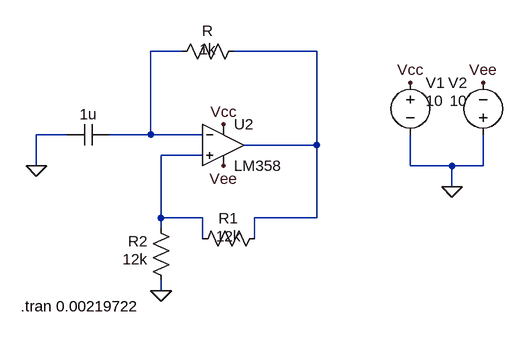
[diagram p0: schematic electronica.asc]
electronica.asc, the LTspice schematic file:
Version 4
SHEET 1 880 680
WIRE 80 0 32 0
WIRE 288 0 160 0
WIRE -96 128 -144 128
WIRE 32 128 32 0
WIRE 32 128 -32 128
WIRE 112 128 32 128
WIRE 288 144 288 0
WIRE 288 144 176 144
WIRE 112 160 48 160
WIRE -144 176 -144 128
WIRE 432 176 432 128
WIRE 496 176 432 176
WIRE 544 176 544 128
WIRE 544 176 496 176
WIRE 496 208 496 176
WIRE 48 256 48 160
WIRE 112 256 48 256
WIRE 288 256 288 144
WIRE 288 256 192 256
WIRE 48 272 48 256
WIRE 112 288 112 256
WIRE 192 288 192 256
WIRE 48 368 48 352
FLAG 496 208 0
FLAG 432 48 Vcc
FLAG 544 48 Vee
FLAG 144 176 Vee
FLAG 144 112 Vcc
FLAG -144 176 0
FLAG 48 368 0
SYMBOL res 176 -16 R90
WINDOW 0 0 56 VBottom 2
WINDOW 3 28 56 VBottom 2
SYMATTR InstName R
SYMATTR Value 1k
SYMBOL res 208 272 R90
WINDOW 0 0 56 VBottom 2
WINDOW 3 28 56 VBottom 2
SYMATTR InstName R1
SYMATTR Value 12k
SYMBOL res 64 368 R180
WINDOW 0 36 76 Left 2
WINDOW 3 36 48 Left 2
SYMATTR InstName R2
SYMATTR Value 12k
SYMBOL cap -32 112 R90
WINDOW 0 0 32 VBottom 2
WINDOW 3 32 32 VTop 2
SYMATTR InstName 1u
SYMATTR Value ""
SYMBOL voltage 432 32 R0
WINDOW 123 0 0 Left 0
WINDOW 39 0 0 Left 0
WINDOW 3 24 44 Left 2
SYMATTR InstName V1
SYMATTR Value 10
SYMBOL voltage 544 144 R180
WINDOW 0 24 96 Left 2
WINDOW 3 24 68 Left 2
WINDOW 123 0 0 Left 0
WINDOW 39 0 0 Left 0
SYMATTR InstName V2
SYMATTR Value 10
SYMBOL Opamps\\LM358 144 80 R0
SYMATTR InstName U2
TEXT -168 392 Left 2 !.tran 0.00219722

The netlist it stands for:
* electronica.asc
R N002 N001 1k
R1 N002 N003 12k
R2 0 N003 12k
C§1u N001 0
V1 Vcc 0 10
V2 0 Vee 10
XU2 N003 N001 Vcc Vee N002 LM358  ; pins In+ In- V+ V- OUT
.tran 0.00219722
.backanno
.end